# Altium schematic sheet 11-Stimulation.SchDoc: Stimulation
size A2; DocumentNumber: 11; SheetNumber: 11; SheetTotal: 15
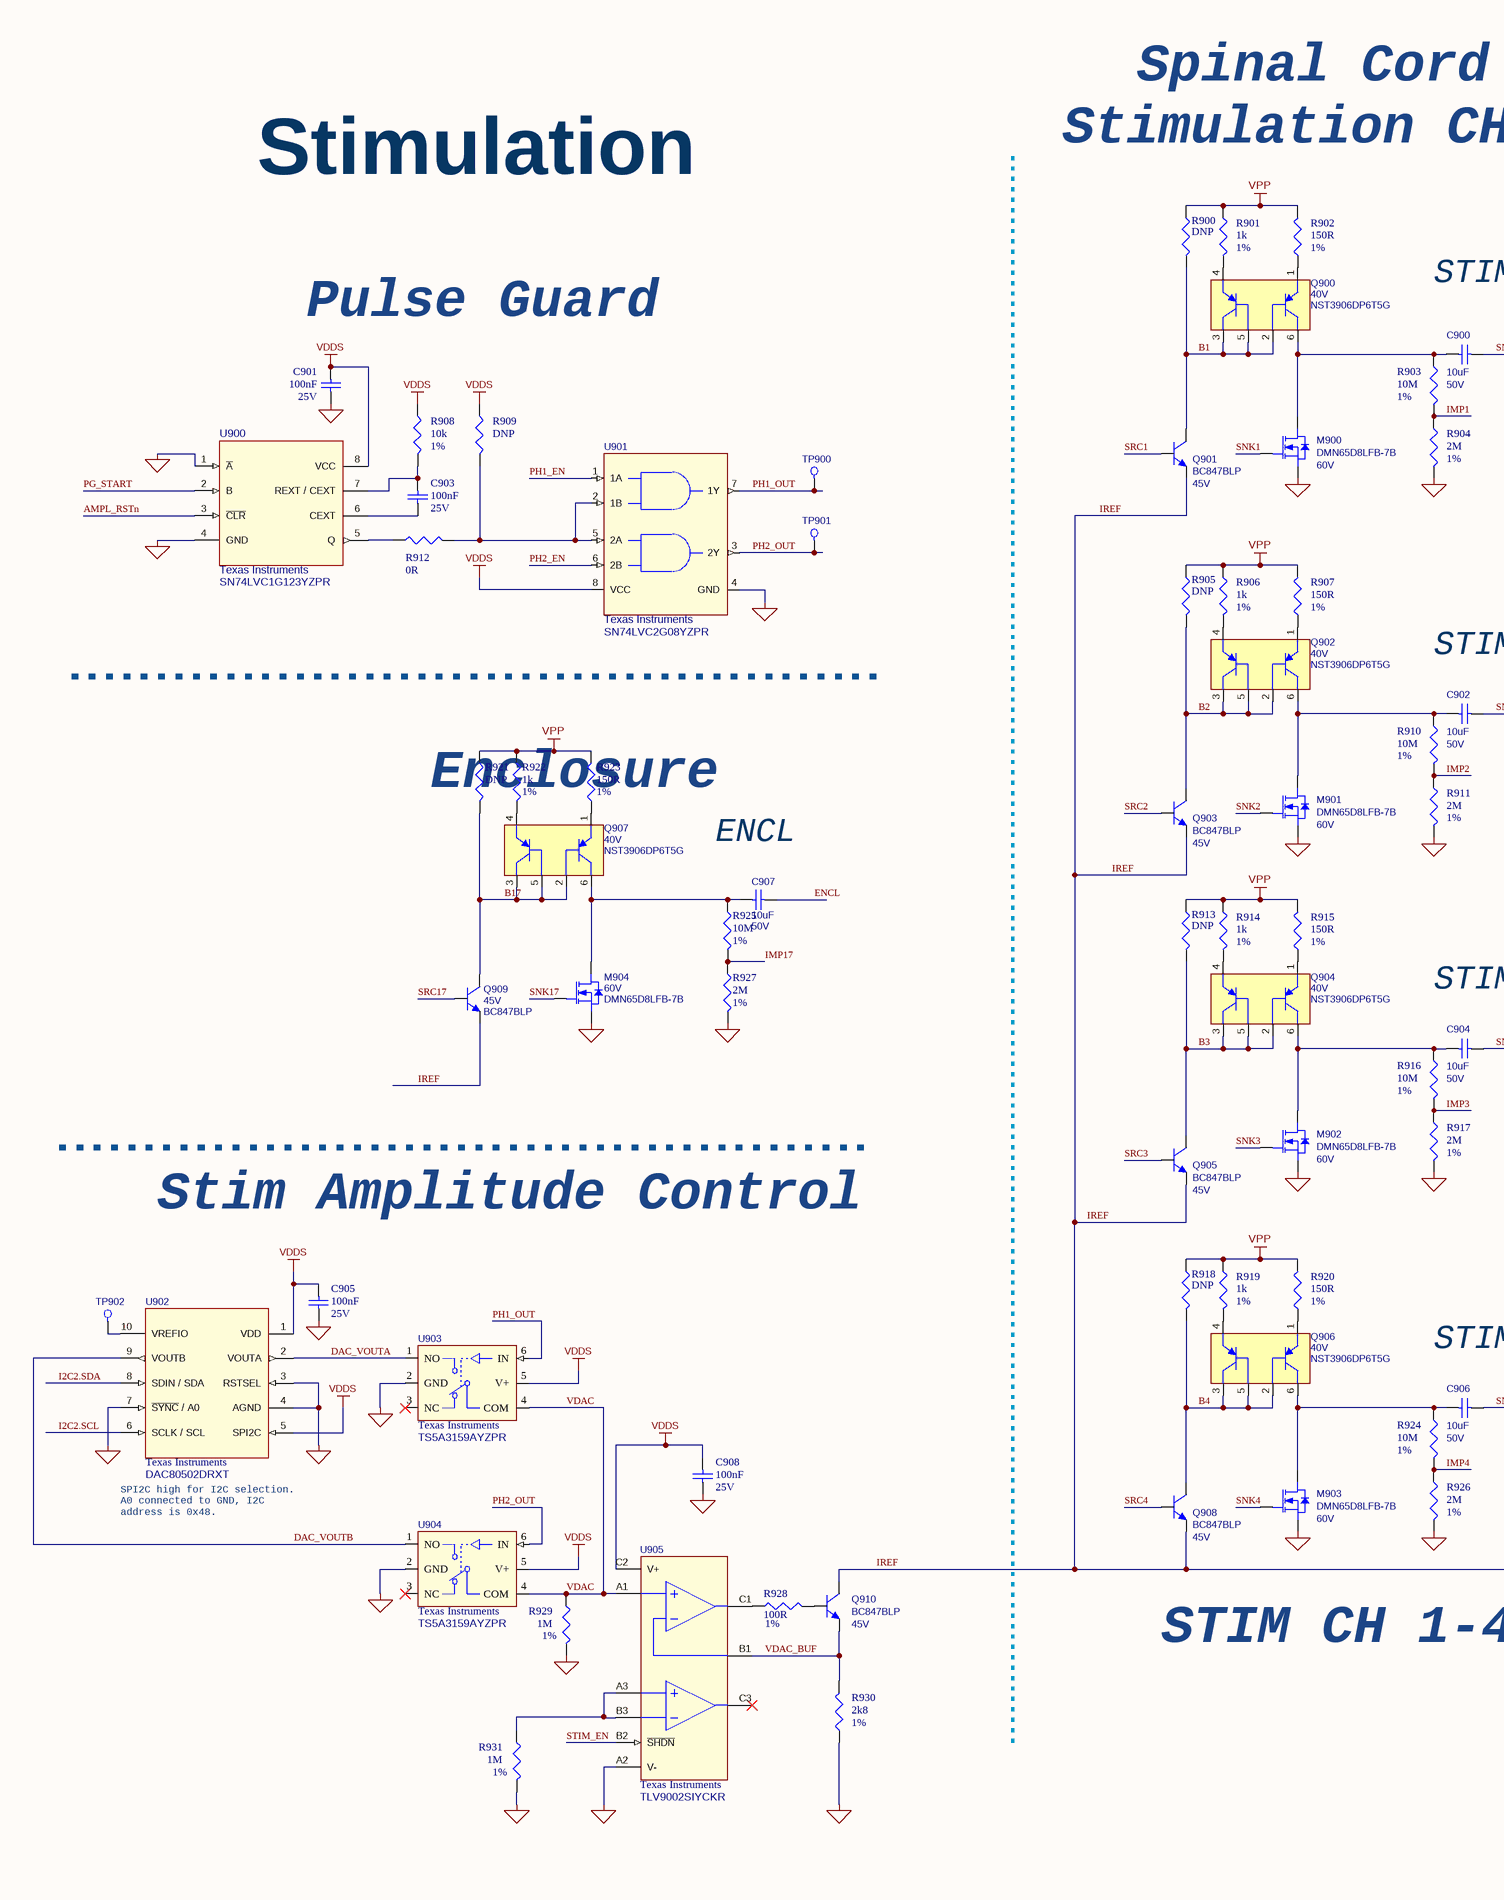
[diagram p0: 11-Stimulation.SchDoc, left]
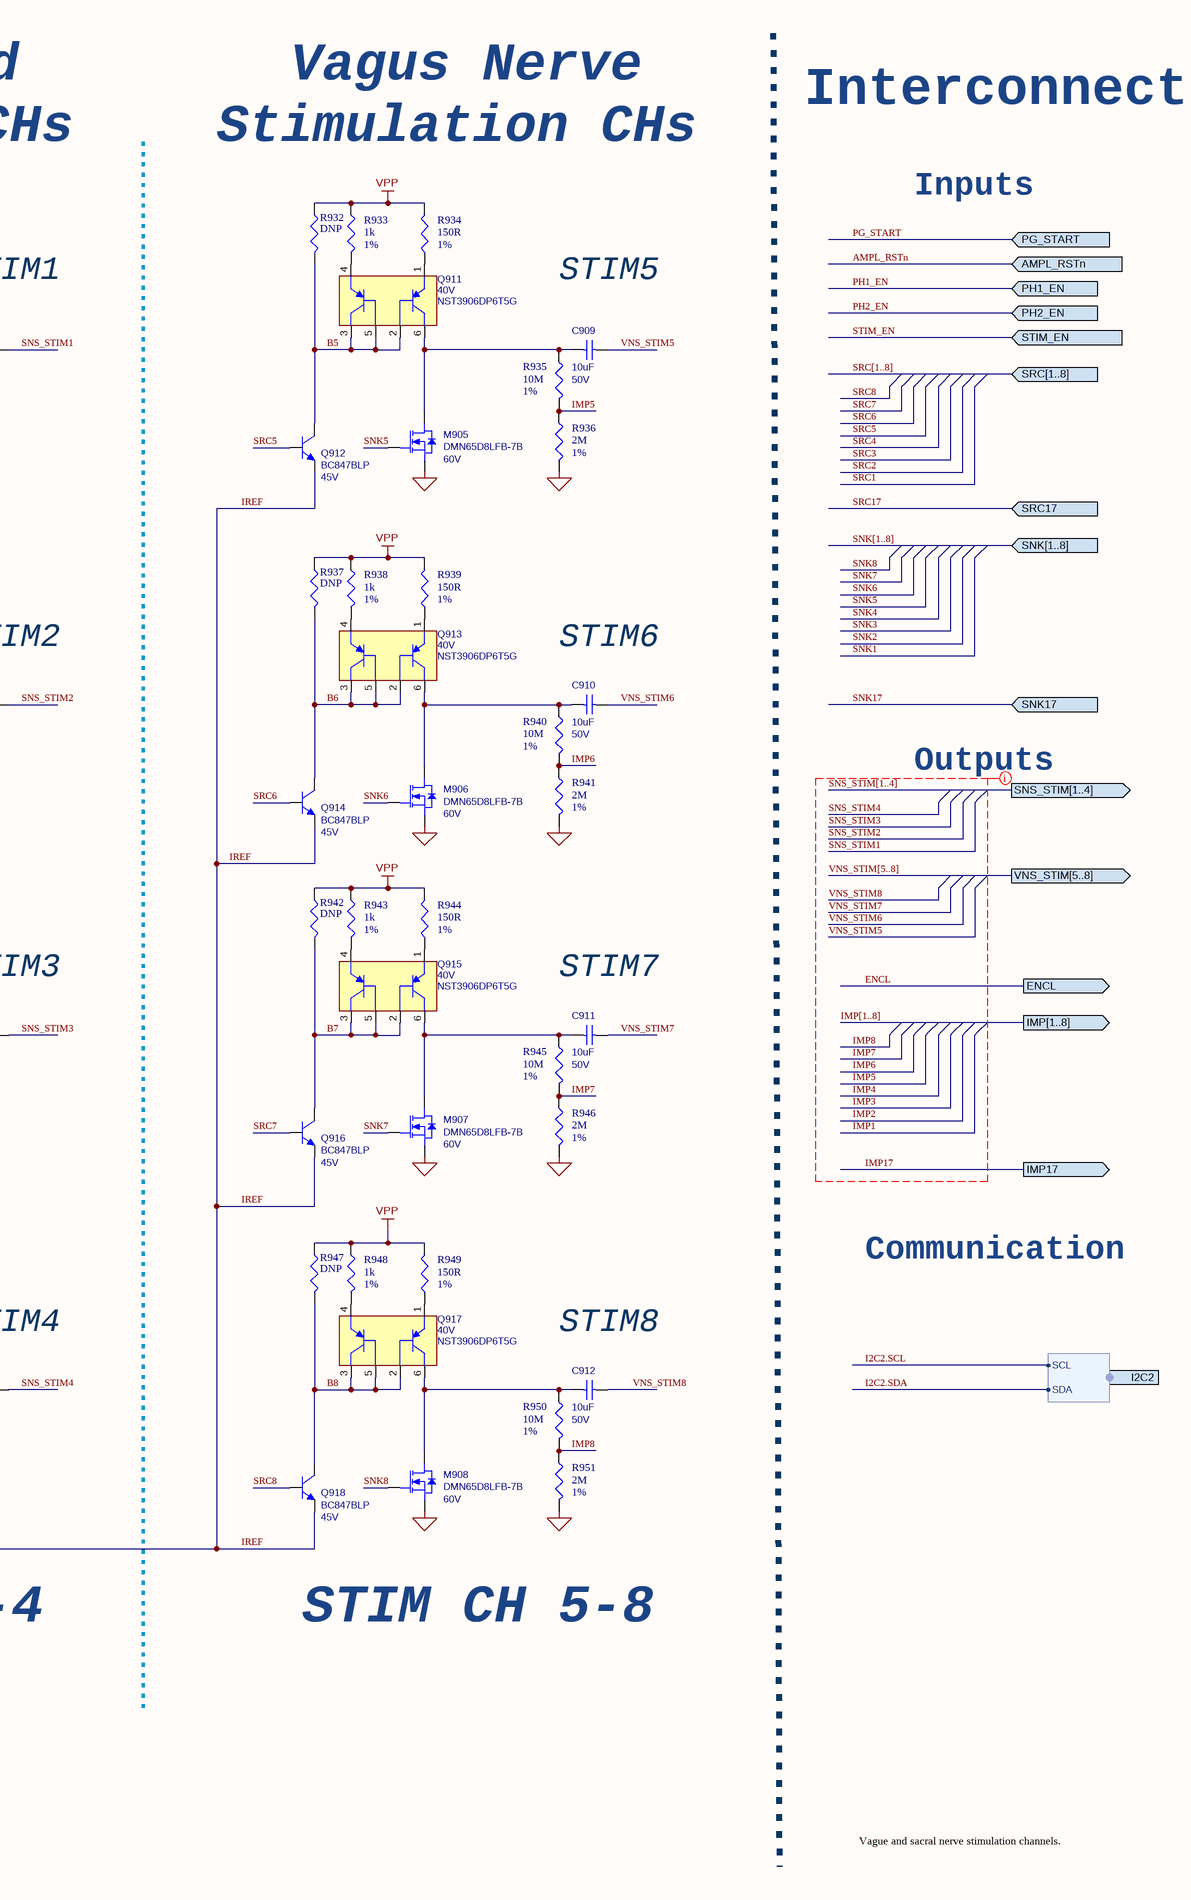
[diagram p1: 11-Stimulation.SchDoc, right]

## Parts
C900  value 10uF  Rating: 50V  [CAP0805_REDUCED]  (hidden comment: GRM21BR61H106ME43L)
C901  value 100nF  Rated DC Voltage (URdc): 25V  [C0201_C]  (hidden comment: GRM033R61E104KE14J)
C902  value 10uF  Rating: 50V  [CAP0805_REDUCED]  (hidden comment: GRM21BR61H106ME43L)
C903  value 100nF  Rated DC Voltage (URdc): 25V  [C0201_C]  (hidden comment: GRM033R61E104KE14J)
C904  value 10uF  Rating: 50V  [CAP0805_REDUCED]  (hidden comment: GRM21BR61H106ME43L)
C905  value 100nF  Rated DC Voltage (URdc): 25V  [C0201_C]  (hidden comment: GRM033R61E104KE14J)
C906  value 10uF  Rating: 50V  [CAP0805_REDUCED]  (hidden comment: GRM21BR61H106ME43L)
C907  value 10uF  Rating: 50V  [CAP0805_REDUCED]  (hidden comment: GRM21BR61H106ME43L)
C908  value 100nF  Rated DC Voltage (URdc): 25V  [C0201_C]  (hidden comment: GRM033R61E104KE14J)
C909  value 10uF  Rating: 50V  [CAP0805_REDUCED]  (hidden comment: GRM21BR61H106ME43L)
C910  value 10uF  Rating: 50V  [CAP0805_REDUCED]  (hidden comment: GRM21BR61H106ME43L)
C911  value 10uF  Rating: 50V  [CAP0805_REDUCED]  (hidden comment: GRM21BR61H106ME43L)
C912  value 10uF  Rating: 50V  [CAP0805_REDUCED]  (hidden comment: GRM21BR61H106ME43L)
M900  Rating: 60V  [DIODESINC_X1-DFN1006-3]  (hidden comment: DMN65D8LFB-7B)
M901  Rating: 60V  [DIODESINC_X1-DFN1006-3]  (hidden comment: DMN65D8LFB-7B)
M902  Rating: 60V  [DIODESINC_X1-DFN1006-3]  (hidden comment: DMN65D8LFB-7B)
M903  Rating: 60V  [DIODESINC_X1-DFN1006-3]  (hidden comment: DMN65D8LFB-7B)
M904  Rating: 60V  [DIODESINC_X1-DFN1006-3]  (hidden comment: DMN65D8LFB-7B)
M905  Rating: 60V  [DIODESINC_X1-DFN1006-3]  (hidden comment: DMN65D8LFB-7B)
M906  Rating: 60V  [DIODESINC_X1-DFN1006-3]  (hidden comment: DMN65D8LFB-7B)
M907  Rating: 60V  [DIODESINC_X1-DFN1006-3]  (hidden comment: DMN65D8LFB-7B)
M908  Rating: 60V  [DIODESINC_X1-DFN1006-3]  (hidden comment: DMN65D8LFB-7B)
Q900  Rating: 40V  [DIODESINC_SOT-963-6]  (hidden comment: NST3906DP6T5G)
Q901  value BC847BLP  Rating: 45V  [DIODESINC_X1-DFN1006-3]  (hidden comment: BC847BLP-7B)
Q902  Rating: 40V  [DIODESINC_SOT-963-6]  (hidden comment: NST3906DP6T5G)
Q903  value BC847BLP  Rating: 45V  [DIODESINC_X1-DFN1006-3]  (hidden comment: BC847BLP-7B)
Q904  Rating: 40V  [DIODESINC_SOT-963-6]  (hidden comment: NST3906DP6T5G)
Q905  value BC847BLP  Rating: 45V  [DIODESINC_X1-DFN1006-3]  (hidden comment: BC847BLP-7B)
Q906  Rating: 40V  [DIODESINC_SOT-963-6]  (hidden comment: NST3906DP6T5G)
Q907  Rating: 40V  [DIODESINC_SOT-963-6]  (hidden comment: NST3906DP6T5G)
Q908  value BC847BLP  Rating: 45V  [DIODESINC_X1-DFN1006-3]  (hidden comment: BC847BLP-7B)
Q909  value BC847BLP  Rating: 45V  [DIODESINC_X1-DFN1006-3]  (hidden comment: BC847BLP-7B)
Q910  value BC847BLP  Rating: 45V  [DIODESINC_X1-DFN1006-3]  (hidden comment: BC847BLP-7B)
Q911  Rating: 40V  [DIODESINC_SOT-963-6]  (hidden comment: NST3906DP6T5G)
Q912  value BC847BLP  Rating: 45V  [DIODESINC_X1-DFN1006-3]  (hidden comment: BC847BLP-7B)
Q913  Rating: 40V  [DIODESINC_SOT-963-6]  (hidden comment: NST3906DP6T5G)
Q914  value BC847BLP  Rating: 45V  [DIODESINC_X1-DFN1006-3]  (hidden comment: BC847BLP-7B)
Q915  Rating: 40V  [DIODESINC_SOT-963-6]  (hidden comment: NST3906DP6T5G)
Q916  value BC847BLP  Rating: 45V  [DIODESINC_X1-DFN1006-3]  (hidden comment: BC847BLP-7B)
Q917  Rating: 40V  [DIODESINC_SOT-963-6]  (hidden comment: NST3906DP6T5G)
Q918  value BC847BLP  Rating: 45V  [DIODESINC_X1-DFN1006-3]  (hidden comment: BC847BLP-7B)
R900  value DNP  [R0201_C]  (hidden comment: RES_DNP_0201)  (no BOM)
R901  value 1k  Tolerance: 1%  [R0201_C]  (hidden comment: CRCW02011K00FNED)
R902  value 150R  Tolerance: 1%  [R0201_C]  (hidden comment: CRCW0201150RFNED)
R903  value 10M  Tolerance: 1%  [R0201_C]  (hidden comment: CRCW020110M0FNED)
R904  value 2M  Tolerance: 1%  [R0201_C]  (hidden comment: CRCW02012M00FNED)
R905  value DNP  [R0201_C]  (hidden comment: RES_DNP_0201)  (no BOM)
R906  value 1k  Tolerance: 1%  [R0201_C]  (hidden comment: CRCW02011K00FNED)
R907  value 150R  Tolerance: 1%  [R0201_C]  (hidden comment: CRCW0201150RFNED)
R908  value 10k  Tolerance: 1%  [R0201_C]  (hidden comment: CRCW020110K0FNED)
R909  value DNP  [R0201_C]  (hidden comment: RES_DNP_0201)  (no BOM)
R910  value 10M  Tolerance: 1%  [R0201_C]  (hidden comment: CRCW020110M0FNED)
R911  value 2M  Tolerance: 1%  [R0201_C]  (hidden comment: CRCW02012M00FNED)
R912  value 0R  [R0201_C]  (hidden comment: CRCW02010000Z0ED)
R913  value DNP  [R0201_C]  (hidden comment: RES_DNP_0201)  (no BOM)
R914  value 1k  Tolerance: 1%  [R0201_C]  (hidden comment: CRCW02011K00FNED)
R915  value 150R  Tolerance: 1%  [R0201_C]  (hidden comment: CRCW0201150RFNED)
R916  value 10M  Tolerance: 1%  [R0201_C]  (hidden comment: CRCW020110M0FNED)
R917  value 2M  Tolerance: 1%  [R0201_C]  (hidden comment: CRCW02012M00FNED)
R918  value DNP  [R0201_C]  (hidden comment: RES_DNP_0201)  (no BOM)
R919  value 1k  Tolerance: 1%  [R0201_C]  (hidden comment: CRCW02011K00FNED)
R920  value 150R  Tolerance: 1%  [R0201_C]  (hidden comment: CRCW0201150RFNED)
R921  value DNP  [R0201_C]  (hidden comment: RES_DNP_0201)  (no BOM)
R922  value 1k  Tolerance: 1%  [R0201_C]  (hidden comment: CRCW02011K00FNED)
R923  value 150R  Tolerance: 1%  [R0201_C]  (hidden comment: CRCW0201150RFNED)
R924  value 10M  Tolerance: 1%  [R0201_C]  (hidden comment: CRCW020110M0FNED)
R925  value 10M  Tolerance: 1%  [R0201_C]  (hidden comment: CRCW020110M0FNED)
R926  value 2M  Tolerance: 1%  [R0201_C]  (hidden comment: CRCW02012M00FNED)
R927  value 2M  Tolerance: 1%  [R0201_C]  (hidden comment: CRCW02012M00FNED)
R928  value 100R  Tolerance: 1%  [R0201_C]  (hidden comment: CRCW0201100RFNED)
R929  value 1M  Tolerance: 1%  [R0201_C]  (hidden comment: CRCW02011M00FNED)
R930  value 2k8  Tolerance: 1%  [R0201_C]  (hidden comment: CRCW02012K80FNED)
R931  value 1M  Tolerance: 1%  [R0201_C]  (hidden comment: CRCW02011M00FNED)
R932  value DNP  [R0201_C]  (hidden comment: RES_DNP_0201)  (no BOM)
R933  value 1k  Tolerance: 1%  [R0201_C]  (hidden comment: CRCW02011K00FNED)
R934  value 150R  Tolerance: 1%  [R0201_C]  (hidden comment: CRCW0201150RFNED)
R935  value 10M  Tolerance: 1%  [R0201_C]  (hidden comment: CRCW020110M0FNED)
R936  value 2M  Tolerance: 1%  [R0201_C]  (hidden comment: CRCW02012M00FNED)
R937  value DNP  [R0201_C]  (hidden comment: RES_DNP_0201)  (no BOM)
R938  value 1k  Tolerance: 1%  [R0201_C]  (hidden comment: CRCW02011K00FNED)
R939  value 150R  Tolerance: 1%  [R0201_C]  (hidden comment: CRCW0201150RFNED)
R940  value 10M  Tolerance: 1%  [R0201_C]  (hidden comment: CRCW020110M0FNED)
R941  value 2M  Tolerance: 1%  [R0201_C]  (hidden comment: CRCW02012M00FNED)
R942  value DNP  [R0201_C]  (hidden comment: RES_DNP_0201)  (no BOM)
R943  value 1k  Tolerance: 1%  [R0201_C]  (hidden comment: CRCW02011K00FNED)
R944  value 150R  Tolerance: 1%  [R0201_C]  (hidden comment: CRCW0201150RFNED)
R945  value 10M  Tolerance: 1%  [R0201_C]  (hidden comment: CRCW020110M0FNED)
R946  value 2M  Tolerance: 1%  [R0201_C]  (hidden comment: CRCW02012M00FNED)
R947  value DNP  [R0201_C]  (hidden comment: RES_DNP_0201)  (no BOM)
R948  value 1k  Tolerance: 1%  [R0201_C]  (hidden comment: CRCW02011K00FNED)
R949  value 150R  Tolerance: 1%  [R0201_C]  (hidden comment: CRCW0201150RFNED)
R950  value 10M  Tolerance: 1%  [R0201_C]  (hidden comment: CRCW020110M0FNED)
R951  value 2M  Tolerance: 1%  [R0201_C]  (hidden comment: CRCW02012M00FNED)
TP900  Test Point  [testpad_0.9mm]  (value not drawn)  (no BOM)
TP901  Test Point  [testpad_0.9mm]  (value not drawn)  (no BOM)
TP902  Test Point  [testpad_0.9mm]  (value not drawn)  (no BOM)
U900  Manufacturer: Texas Instruments  [TI_YZP0008]  (hidden comment: SN74LVC1G123YZPR)
U901  Manufacturer: Texas Instruments  [TI_YZP0008]  (hidden comment: SN74LVC2G08YZPR)
U902  Manufacturer: Texas Instruments  [TI_DRX0010A]  (hidden comment: DAC80502DRXT)
U903  Manufacturer: Texas Instruments  [TI_YZP6]  (hidden comment: TS5A3159AYZPR)
U904  Manufacturer: Texas Instruments  [TI_YZP6]  (hidden comment: TS5A3159AYZPR)
U905  Manufacturer: Texas Instruments  [TI_YCK0009]  (hidden comment: TLV9002SIYCKR)

## Ports
AMPL_RSTn (in), ENCL (out), I2C2 (harness I2C), IMP17 (out), IMP[1..8] (out), PG_START (in), PH1_EN (in), PH2_EN (in), SNK17 (in), SNK[1..8] (in), SNS_STIM[1..4] (out), SRC17 (in), SRC[1..8] (in), STIM_EN (in), VNS_STIM[5..8] (out)

## Harnesses
I2C: SDA, SCL

## Nets
GND: C901.1 C905.1 C908.1 M900.2(S) M901.2(S) M902.2(S) M903.2(S) M904.2(S) M905.2(S) M906.2(S) M907.2(S) M908.2(S) R904.2 R911.2 R917.2 R926.2 R927.2 R929.2 R930.1 R931.2 R936.2 R941.2 R946.2 R951.2 U900.1(~{A}) U900.4(GND) U901.4(GND) U902.3(RSTSEL) U902.4(AGND) U902.7(~{SYNC}_/_A0) U903.2(GND) U904.2(GND) U905.A2(V-)
VDDS: C901.2 C905.2 C908.2 R908.1 R909.1 U900.8(VCC) U901.8(VCC) U902.1(VDD) U902.5(SPI2C) U903.5(V+) U904.5(V+) U905.C2(V+)
VPP: R900.1 R901.1 R902.2 R905.1 R906.1 R907.2 R913.1 R914.1 R915.2 R918.1 R919.1 R920.2 R921.1 R922.1 R923.2 R932.1 R933.1 R934.2 R937.1 R938.1 R939.2 R942.1 R943.1 R944.2 R947.1 R948.1 R949.2
AMPL_RSTn: U900.3(~{CLR}) ; port AMPL_RSTn
B1: Q900.2(B2) Q900.3(C1) Q900.5(B1) Q901.3(C) R900.2
B2: Q902.2(B2) Q902.3(C1) Q902.5(B1) Q903.3(C) R905.2
B3: Q904.2(B2) Q904.3(C1) Q904.5(B1) Q905.3(C) R913.2
B4: Q906.2(B2) Q906.3(C1) Q906.5(B1) Q908.3(C) R918.2
B5: Q911.2(B2) Q911.3(C1) Q911.5(B1) Q912.3(C) R932.2
B6: Q913.2(B2) Q913.3(C1) Q913.5(B1) Q914.3(C) R937.2
B7: Q915.2(B2) Q915.3(C1) Q915.5(B1) Q916.3(C) R942.2
B8: Q917.2(B2) Q917.3(C1) Q917.5(B1) Q918.3(C) R947.2
B17: Q907.2(B2) Q907.3(C1) Q907.5(B1) Q909.3(C) R921.2
DAC_VOUTA: U902.2(VOUTA) U903.1(NO)
DAC_VOUTB: U902.9(VOUTB) U904.1(NO)
ENCL: C907.2 ; port ENCL
I2C2.SCL: U902.6(SCLK_/_SCL) ; port I2C2.SCL
I2C2.SDA: U902.8(SDIN_/_SDA) ; port I2C2.SDA
IMP1: R903.2 R904.1
IMP2: R910.2 R911.1
IMP3: R916.2 R917.1
IMP4: R924.2 R926.1
IMP5: R935.2 R936.1
IMP6: R940.2 R941.1
IMP7: R945.2 R946.1
IMP8: R950.2 R951.1
IMP17: R925.2 R927.1 ; port IMP17
IREF: Q901.2(E) Q903.2(E) Q905.2(E) Q908.2(E) Q909.2(E) Q910.3(C) Q912.2(E) Q914.2(E) Q916.2(E) Q918.2(E)
PG_START: U900.2(B) ; port PG_START
PH1_EN: U901.1(1A) ; port PH1_EN
PH1_OUT: TP900.1 U901.7(1Y) U903.6(IN)
PH2_EN: U901.6(2B) ; port PH2_EN
PH2_OUT: TP901.1 U901.3(2Y) U904.6(IN)
SNK1: M900.1(G)
SNK2: M901.1(G)
SNK3: M902.1(G)
SNK4: M903.1(G)
SNK5: M905.1(G)
SNK6: M906.1(G)
SNK7: M907.1(G)
SNK8: M908.1(G)
SNK17: M904.1(G) ; port SNK17
SNS_STIM1: C900.2
SNS_STIM2: C902.2
SNS_STIM3: C904.2
SNS_STIM4: C906.2
SRC1: Q901.1(B)
SRC2: Q903.1(B)
SRC3: Q905.1(B)
SRC4: Q908.1(B)
SRC5: Q912.1(B)
SRC6: Q914.1(B)
SRC7: Q916.1(B)
SRC8: Q918.1(B)
SRC17: Q909.1(B) ; port SRC17
STIM_EN: U905.B2(~{SHDN}) ; port STIM_EN
VDAC: R929.1 U903.4(COM) U904.4(COM) U905.A1(IN1+)
VDAC_BUF: Q910.2(E) R930.2 U905.B1(IN1-)
VNS_STIM5: C909.2
VNS_STIM6: C910.2
VNS_STIM7: C911.2
VNS_STIM8: C912.2
NetC900_1: C900.1 M900.3(D) Q900.6(C2) R903.1
NetC902_1: C902.1 M901.3(D) Q902.6(C2) R910.1
NetC903_1: C903.1 U900.6(CEXT)
NetC903_2: C903.2 R908.2 U900.7(REXT_/_CEXT)
NetC904_1: C904.1 M902.3(D) Q904.6(C2) R916.1
NetC906_1: C906.1 M903.3(D) Q906.6(C2) R924.1
NetC907_1: C907.1 M904.3(D) Q907.6(C2) R925.1
NetC909_1: C909.1 M905.3(D) Q911.6(C2) R935.1
NetC910_1: C910.1 M906.3(D) Q913.6(C2) R940.1
NetC911_1: C911.1 M907.3(D) Q915.6(C2) R945.1
NetC912_1: C912.1 M908.3(D) Q917.6(C2) R950.1
NetQ900_1: Q900.1(E2) R902.1
NetQ900_4: Q900.4(E1) R901.2
NetQ902_1: Q902.1(E2) R907.1
NetQ902_4: Q902.4(E1) R906.2
NetQ904_1: Q904.1(E2) R915.1
NetQ904_4: Q904.4(E1) R914.2
NetQ906_1: Q906.1(E2) R920.1
NetQ906_4: Q906.4(E1) R919.2
NetQ907_1: Q907.1(E2) R923.1
NetQ907_4: Q907.4(E1) R922.2
NetQ910_1: Q910.1(B) R928.2
NetQ911_1: Q911.1(E2) R934.1
NetQ911_4: Q911.4(E1) R933.2
NetQ913_1: Q913.1(E2) R939.1
NetQ913_4: Q913.4(E1) R938.2
NetQ915_1: Q915.1(E2) R944.1
NetQ915_4: Q915.4(E1) R943.2
NetQ917_1: Q917.1(E2) R949.1
NetQ917_4: Q917.4(E1) R948.2
NetR909_2: R909.2 R912.2 U901.2(1B) U901.5(2A)
NetR912_1: R912.1 U900.5(Q)
NetR928_1: R928.1 U905.C1(OUT1)
NetR931_1: R931.1 U905.A3(IN2+) U905.B3(IN2-)
NetTP902_1: TP902.1 U902.10(VREFIO)

Not connected (* = marked no-connect by the designer): U903 3(NC)*; U904 3(NC)*; U905 C3(OUT2)*

## Buses and harness runs
bus IMP[1..8] = port IMP[1..8]
bus SNK[1..8] = port SNK[1..8]
bus SNS_STIM[1..4] = port SNS_STIM[1..4]
bus SRC[1..8] = port SRC[1..8]
bus VNS_STIM[5..8] = port VNS_STIM[5..8]

## Layout directives
net class ANALOG: ENCL, IMP1, IMP2, IMP3, IMP4, IMP5, IMP6, IMP7, IMP8, IMP17, IMP[1..8], SNS_STIM1, SNS_STIM2, SNS_STIM3, SNS_STIM4, SNS_STIM[1..4], VNS_STIM5, VNS_STIM6, VNS_STIM7, VNS_STIM8, VNS_STIM[5..8]

## Notes on the sheet
- Spinal Cord
- Vagus Nerve
- Interconnect
- Stimulation
- Stimulation CHs
- Inputs
- Pulse Guard
- STIM1
- STIM5
- STIM2
- STIM6
- Enclosure
- Outputs
- ENCL
- STIM3
- STIM7
- Stim Amplitude Control
- Communication
- STIM4
- STIM8
- SPI2C high for I2C selection. A0 connected to GND, I2C address is 0x48.
- STIM CH 1-4
- STIM CH 5-8
- Vague and sacral nerve stimulation channels.
- Project:
- Schematic:
- Design by:
- Date:
- Ver:
- .
- Comments:
- Reviewed by:

## Library data of the parts
C900 C902 C904 C906 C907 C909-C912 = GRM21BR61H106ME43L: Capacitor, 10uF, X5R, 50V, 10%, 0805; Manufacturer: Murata; Review: 020823; Length (mm): 2.00 ±0.20; Medical Grade MFR: N/A; Medical Grade MFR PN: N/A; PCB Footprint: cap0805_reduced; Thickness (mm): 1.25 ±0.20; Width (mm): 1.25 ±0.20; Category: Capacitor; Package Description: 0805; Supplier 1: Digi-Key; Supplier Part Number 1: 490-18664-1-ND; Status: Approved; Manufacturer Part Number: GRM21BR61H106ME43L
C901 C903 C905 C908 = GRM033R61E104KE14J: Ceramic Capacitor, Multilayer, Ceramic, 25V, 10% +Tol, 10% -Tol, X5R, 15% TC, 0.1uF, Surface Mount, 0201; Manufacturer: Murata; Multilayer: Yes; Category: Ceramic Capacitors; Supplier: Digikey; Supplier Part Number: 490-14571-1-ND; Manufacturer Part Number: GRM033R61E104KE14J; RoHS: Yes; Stock: 1540851; Pricing: 1=0,1, 10=0,033, 50=0,0192, 100=0,0148, 500=0,01118, 1000=0,00878, 2500=0,00798, 5000=0,00734 (USD); Mounting Technology: Surface Mount; Pins: 2; Dielectric Material: Ceramic; Package Shape: Rectangular; Case/Package: 0201; Terminal Finish: Nickel; Min Operating Temperature: -55°C; Max Operating Temperature: 85°C; JESD-609 Code: e3; Capacitor Type: Ceramic; Tolerance  (fill in as +-): 10%; Package Style: SMTMeter; Packaging: Tape and Reel; Tolerance (fill in as +-): 10%; Temperature Characteristics Code: X5R; Termination: Wraparound; Length: 0.6mm; Width: 0.3mm; Height: 0.3mm; Reach SVHC Compliant: Yes; RoHS Compliant: Yes; ComponentLink1URL: https://psearch.en.murata.com:443/capacitor/product/GRM033R61E104KE14%23.pdf?src-supplier=IHS+Markit; ComponentLink1Description: https://psearch.en.murata.com:443/capacitor/product/GRM033R61E104KE14%23.pdf?src-supplier=IHS+Markit; ComponentLink2URL: http://www.mouser.com/ds/2/281/c02e-2905.pdf?src-supplier=Mouser; ComponentLink2Description: http://www.mouser.com/ds/2/281/c02e-2905.pdf?src-supplier=Mouser; ComponentLink3URL: http://search.murata.co.jp/Ceramy/image/img/A01X/G101/ENG/GRM033R61E104KE14-01.pdf?src-supplier=Digikey; ComponentLink3Description: http://search.murata.co.jp/Ceramy/image/img/A01X/G101/ENG/GRM033R61E104KE14-01.pdf?src-supplier=Digikey; ComponentLink4URL: https://search.murata.co.jp/Ceramy/image/img/A01X/G101/ENG/GRM033R61E104KE14-01.pdf?src-supplier=Digikey; ComponentLink4Description: https://search.murata.co.jp/Ceramy/image/img/A01X/G101/ENG/GRM033R61E104KE14-01.pdf?src-supplier=Digikey; Supplier 1: Arrow Electronics; Supplier Part Number 1: GRM033R61E104KE14J
M900-M908 = DMN65D8LFB-7B: MOSFET, N-Chan, 60V, 210mA, DFN1006; Manufacturer: Diodes Inc; Medical Grade MFR: TBD; Review: 020823; Category: Transistor; Length (mm): 1.00 ±0.08; Medical Grade MFR PN: TBD; PCB Footprint: TBD; Thickness (mm): 0.50 ±0.03; Value: DMN65D8LFB-7B; Width (mm): 0.60 ±0.08; Supplier 1: Digi-Key; Supplier Part Number 1: DMN65D8LFB-7BDICT-ND; Status: Approved; Manufacturer Part Number: DMN65D8LFB-7B
Q900 Q902 Q904 Q906 Q907 Q911 Q913 Q915 Q917 = NST3906DP6T5G: TRANS 2PNP 40V 0.2A SOT963; Manufacturer: ON Semi; Medical Grade MFR: TBD; Category: Transistor; Length (mm): 1.00 ±0.05; Medical Grade MFR PN: TBD; PCB Footprint: TBD; Thickness (mm): 0.45 ±0.05; Value: NST3906DP6T5G; Width (mm): 1.00 ±0.05; Package Description: SOT963; Supplier 1: Digi-Key; Supplier Part Number 1: NST3906DP6T5GOSCT-ND; Status: *; Review: *; Manufacturer Part Number: NST3906DP6T5G
Q901 Q903 Q905 Q908-Q910 Q912 Q914 Q916 Q918 = BC847BLP-7B: Transistor, NPN, 45V, 100mA, DFN1006; Manufacturer: Diodes Inc; Medical Grade MFR: TBD; Category: Transistor; Length (mm): 1.00 ±0.08; Medical Grade MFR PN: TBD; PCB Footprint: TBD; Thickness (mm): 0.50 ±0.03; Width (mm): 0.60 ±0.08; Supplier 1: Digi-Key; Supplier Part Number 1: BC847BLP-7BDICT-ND; Status: *; Review: *; Manufacturer Part Number: BC847BLP-7B
R901 R906 R914 R919 R922 R933 R938 R943 R948 = CRCW02011K00FNED: Fixed Resistor, Metal Glaze/thick Film, 0.05W, 1000ohm, 30V, 1% +/-Tol, 200ppm/Cel, Surface Mount, 0201; Manufacturer: Vishay; Medical Grade MFR: Mini-Systems; Medical Grade MFR PN: MWA96SM-1001F-NS62TR; Power: 50mW; Rated Temperature: 70°C; Temperature Coefficient: 200ppm/°C; Package Height: 0.23mm; Package Length: 0.6mm; Package Width: 0.3mm; Reference Standard: AEC-Q200; Category: Chip SMD Resistors; Supplier: Digikey; Supplier Part Number: 541-1.00KABCT-ND; Manufacturer Part Number: CRCW02011K00FNED; RoHS: Yes; Stock: 303224; Pricing: 1=0,1, 10=0,037, 50=0,0242, 100=0,0204, 500=0,01426, 1000=0,01241, 5000=0,00924 (USD); Mounting Technology: Surface Mount; Pins: 2; Package Shape: Rectangular; Case/Package: 0201; Terminal Finish: Nickel; Min Operating Temperature: -55°C; Max Operating Temperature: 155°C; JESD-609 Code: e3; Resistor Type: FIXED RESISTOR; Construction: Chip; Package Style: SMTMeter; Packaging: Tape and Reel; Technology: METAL GLAZE/THICK FILM; Termination: Wraparound; Working Voltage: 30V; Reach SVHC Compliant: Yes; RoHS Compliant: Yes; ComponentLink1URL: https://datasheet.ciiva.com:443/pdfs/VipMasterIC/IC/VISH/VISH-S-A0002932828/VISH-S-A0002932828-1.pdf?src-supplier=IHS+Markit; ComponentLink1Description: https://datasheet.ciiva.com:443/pdfs/VipMasterIC/IC/VISH/VISH-S-A0002932828/VISH-S-A0002932828-1.pdf?src-supplier=IHS+Markit; ComponentLink2URL: https://datasheet.ciiva.com/7983/1719906-7983324.pdf?src-supplier=Element14; ComponentLink2Description: https://datasheet.ciiva.com/7983/1719906-7983324.pdf?src-supplier=Element14; ComponentLink3URL: https://datasheet.ciiva.com/7983/1719906-7983323.pdf?src-supplier=Element14; ComponentLink3Description: https://datasheet.ciiva.com/7983/1719906-7983323.pdf?src-supplier=Element14; ComponentLink4URL: https://datasheet.ciiva.com/22692/1719906-22692751.pdf?src-supplier=Element14; ComponentLink4Description: https://datasheet.ciiva.com/22692/1719906-22692751.pdf?src-supplier=Element14; ComponentLink5URL: https://datasheet.ciiva.com/22665/1825492-22665818.pdf?src-supplier=Element14; ComponentLink5Description: https://datasheet.ciiva.com/22665/1825492-22665818.pdf?src-supplier=Element14; ComponentLink6URL: https://datasheet.ciiva.com/2474/crcw0201e3-2474801.pdf?src-supplier=Digikey; ComponentLink6Description: https://datasheet.ciiva.com/2474/crcw0201e3-2474801.pdf?src-supplier=Digikey; ComponentLink7URL: https://datasheet.ciiva.com/2474/crcw0201e3-2474802.pdf?src-supplier=Digikey; ComponentLink7Description: https://datasheet.ciiva.com/2474/crcw0201e3-2474802.pdf?src-supplier=Digikey; ComponentLink8URL: https://datasheet.ciiva.com/2474/crcw0201e3-2474800.pdf?src-supplier=Digikey; ComponentLink8Description: https://datasheet.ciiva.com/2474/crcw0201e3-2474800.pdf?src-supplier=Digikey; ComponentLink9URL: https://datasheet.ciiva.com/22871/70202042-22871422.pdf?src-supplier=Allied+Electronics; ComponentLink9Description: https://datasheet.ciiva.com/22871/70202042-22871422.pdf?src-supplier=Allied+Electronics; ComponentLink10URL: https://datasheet.ciiva.com/3255/crcw0201e3-3255929.pdf?src-supplier=Avnet; ComponentLink10Description: https://datasheet.ciiva.com/3255/crcw0201e3-3255929.pdf?src-supplier=Avnet; Supplier 1: Arrow Electronics; Supplier Part Number 1: CRCW02011K00FNED
R902 R907 R915 R920 R923 R934 R939 R944 R949 = CRCW0201150RFNED: Fixed Resistor, Metal Glaze/thick Film, 0.05W, 150ohm, 30V, 1% +/-Tol, 200ppm/Cel, Surface Mount, 0201; Manufacturer: Vishay; Medical Grade MFR: Mini-Systems; Medical Grade MFR PN: MWA96SM-1500F-NS62TR; Power: 50mW; Rated Temperature: 70°C; Temperature Coefficient: 200ppm/°C; Package Height: 0.23mm; Package Length: 0.6mm; Package Width: 0.3mm; Reference Standard: AEC-Q200; Category: Chip SMD Resistors; Supplier: Digikey; Supplier Part Number: 541-CRCW0201150RFNEDCT-ND; Manufacturer Part Number: CRCW0201150RFNED; RoHS: Yes; Stock: 19000; Pricing: 1=0,1, 10=0,037, 50=0,0242, 100=0,0204, 500=0,01426, 1000=0,01241, 5000=0,00924 (USD); Mounting Technology: Surface Mount; Pins: 2; Package Shape: Rectangular; Case/Package: 0201; Terminal Finish: Nickel; Min Operating Temperature: -55°C; Max Operating Temperature: 155°C; JESD-609 Code: e3; Resistor Type: FIXED RESISTOR; Construction: Chip; Package Style: SMTMeter; Packaging: Tape and Reel; Technology: METAL GLAZE/THICK FILM; Termination: Wraparound; Working Voltage: 30V; Reach SVHC Compliant: Yes; RoHS Compliant: Yes; ComponentLink1URL: https://datasheet.ciiva.com:443/pdfs/VipMasterIC/IC/VISH/VISH-S-A0002932828/VISH-S-A0002932828-1.pdf?src-supplier=IHS+Markit; ComponentLink1Description: https://datasheet.ciiva.com:443/pdfs/VipMasterIC/IC/VISH/VISH-S-A0002932828/VISH-S-A0002932828-1.pdf?src-supplier=IHS+Markit; ComponentLink2URL: https://datasheet.ciiva.com/2577/crcw0201e3-2577126.pdf?src-supplier=Digikey; ComponentLink2Description: https://datasheet.ciiva.com/2577/crcw0201e3-2577126.pdf?src-supplier=Digikey; ComponentLink3URL: https://datasheet.ciiva.com/8969/crcw0201e3-8969797.pdf?src-supplier=Avnet; ComponentLink3Description: https://datasheet.ciiva.com/8969/crcw0201e3-8969797.pdf?src-supplier=Avnet; ComponentLink4URL: https://datasheet.ciiva.com/7777/1719906-7777159.pdf?src-supplier=Element14; ComponentLink4Description: https://datasheet.ciiva.com/7777/1719906-7777159.pdf?src-supplier=Element14; ComponentLink5URL: https://datasheet.ciiva.com/7777/1719906-7777160.pdf?src-supplier=Element14; ComponentLink5Description: https://datasheet.ciiva.com/7777/1719906-7777160.pdf?src-supplier=Element14; Supplier 1: Digikey; Supplier Part Number 1: 541-CRCW0201150RFNEDCT-ND
R903 R910 R916 R924 R925 R935 R940 R945 R950 = CRCW020110M0FNED: Fixed Resistor, Metal Glaze/thick Film, 0.05W, 10000000ohm, 30V, 1% +/-Tol, 200ppm/Cel, Surface Mount, 0201; Manufacturer: Vishay Draloric; Medical Grade MFR: Mini-Systems; Medical Grade MFR PN: MWA96SM-1005F-NS62TR; Power: 50mW; Rated Temperature: 70°C; Temperature Coefficient: 200ppm/°C; Category: Chip SMD Resistors; Supplier: Mouser; Supplier Part Number: 71-CRCW020110M0FNED; Manufacturer Part Number: CRCW020110M0FNED; RoHS: Yes; Stock: 159754; Pricing: 1=0,1, 10=0,024, 50=0,024, 100=0,014, 1000=0,011, 10000=0,006 (USD); Mounting Technology: Surface Mount; Pins: 2; Package Shape: Rectangular; Case/Package: 0201; Terminal Finish: Nickel; Min Operating Temperature: -55°C; Max Operating Temperature: 155°C; JESD-609 Code: e3; Resistor Type: FIXED RESISTOR; Packaging: Tape and Reel; Technology: METAL GLAZE/THICK FILM; Termination: Wraparound; Working Voltage: 30V; Reach SVHC Compliant: Yes; RoHS Compliant: Yes; ComponentLink1URL: https://datasheet.ciiva.com:443/pdfs/VipMasterIC/IC/VISH/VISH-S-A0002932828/VISH-S-A0002932828-1.pdf?src-supplier=IHS+Markit; ComponentLink1Description: https://datasheet.ciiva.com:443/pdfs/VipMasterIC/IC/VISH/VISH-S-A0002932828/VISH-S-A0002932828-1.pdf?src-supplier=IHS+Markit; ComponentLink2URL: https://datasheet.ciiva.com/7673/1719906-7673177.pdf?src-supplier=Element14; ComponentLink2Description: https://datasheet.ciiva.com/7673/1719906-7673177.pdf?src-supplier=Element14; ComponentLink3URL: https://datasheet.ciiva.com/7673/1719906-7673178.pdf?src-supplier=Element14; ComponentLink3Description: https://datasheet.ciiva.com/7673/1719906-7673178.pdf?src-supplier=Element14; ComponentLink4URL: https://datasheet.ciiva.com/22692/1719906-22692711.pdf?src-supplier=Element14; ComponentLink4Description: https://datasheet.ciiva.com/22692/1719906-22692711.pdf?src-supplier=Element14; ComponentLink5URL: https://datasheet.ciiva.com/22665/1700795-22665701.pdf?src-supplier=Element14; ComponentLink5Description: https://datasheet.ciiva.com/22665/1700795-22665701.pdf?src-supplier=Element14; Supplier 1: Digikey; Supplier Part Number 1: 541-CRCW020110M0FNEDCT-ND
R904 R911 R917 R926 R927 R936 R941 R946 R951 = CRCW02012M00FNED: Fixed Resistor, Metal Glaze/thick Film, 0.05W, 2000000ohm, 30V, 1% +/-Tol, 200ppm/Cel, Surface Mount, 0201; Manufacturer: Vishay Draloric; Medical Grade MFR: Mini-Systems; Medical Grade MFR PN: MWA96SM-2004F-NS62TR; Power: 50mW; Rated Temperature: 70°C; Temperature Coefficient: 200ppm/°C; Category: Chip SMD Resistors; Supplier: Digikey; Supplier Part Number: 541-CRCW02012M00FNEDCT-ND; Manufacturer Part Number: CRCW02012M00FNED; RoHS: Yes; Stock: 78038; Pricing: 1=0,1, 10=0,037, 50=0,0242, 100=0,0204, 500=0,01426, 1000=0,01241, 5000=0,00924 (USD); Mounting Technology: Surface Mount; Pins: 2; Package Shape: Rectangular; Case/Package: 0201; Terminal Finish: Nickel; Min Operating Temperature: -55°C; Max Operating Temperature: 155°C; JESD-609 Code: e3; Resistor Type: FIXED RESISTOR; Packaging: Tape and Reel; Technology: METAL GLAZE/THICK FILM; Termination: Wraparound; Working Voltage: 30V; Reach SVHC Compliant: Yes; RoHS Compliant: Yes; ComponentLink1URL: https://datasheet.ciiva.com:443/pdfs/VipMasterIC/IC/VISH/VISH-S-A0002932828/VISH-S-A0002932828-1.pdf?src-supplier=IHS+Markit; ComponentLink1Description: https://datasheet.ciiva.com:443/pdfs/VipMasterIC/IC/VISH/VISH-S-A0002932828/VISH-S-A0002932828-1.pdf?src-supplier=IHS+Markit; ComponentLink2URL: https://datasheet.ciiva.com/7800/1719906-7800936.pdf?src-supplier=Element14; ComponentLink2Description: https://datasheet.ciiva.com/7800/1719906-7800936.pdf?src-supplier=Element14; ComponentLink3URL: https://datasheet.ciiva.com/7800/1719906-7800935.pdf?src-supplier=Element14; ComponentLink3Description: https://datasheet.ciiva.com/7800/1719906-7800935.pdf?src-supplier=Element14; ComponentLink4URL: https://datasheet.ciiva.com/22675/1700795-22675402.pdf?src-supplier=Element14; ComponentLink4Description: https://datasheet.ciiva.com/22675/1700795-22675402.pdf?src-supplier=Element14; ComponentLink5URL: https://datasheet.ciiva.com/29926/crcw0201e3-29926056.pdf?src-supplier=Avnet; ComponentLink5Description: https://datasheet.ciiva.com/29926/crcw0201e3-29926056.pdf?src-supplier=Avnet; Supplier 1: Digikey; Supplier Part Number 1: 541-CRCW02012M00FNEDCT-ND
R908 = CRCW020110K0FNED: Fixed Resistor, Metal Glaze/thick Film, 0.05W, 10000ohm, 30V, 1% +/-Tol, 200ppm/Cel, Surface Mount, 0201; Manufacturer: Vishay; Medical Grade MFR: Mini-Systems; Medical Grade MFR PN: MWA96SM-1002F-NS62TR; Power: 50mW; Rated Temperature: 70°C; Temperature Coefficient: 200ppm/°C; Package Height: 0.23mm; Package Length: 0.6mm; Package Width: 0.3mm; Reference Standard: AEC-Q200; Category: Chip SMD Resistors; Supplier: Digikey; Supplier Part Number: 541-10.0KABCT-ND; Manufacturer Part Number: CRCW020110K0FNED; RoHS: Yes; Stock: 1011530; Pricing: 1=0,1, 10=0,037, 50=0,0242, 100=0,0204, 500=0,01426, 1000=0,01241, 5000=0,00924 (USD); Mounting Technology: Surface Mount; Pins: 2; Package Shape: Rectangular; Case/Package: 0201; Terminal Finish: Nickel; Min Operating Temperature: -55°C; Max Operating Temperature: 155°C; JESD-609 Code: e3; Resistor Type: FIXED RESISTOR; Construction: Chip; Package Style: SMTMeter; Packaging: Tape and Reel; Technology: METAL GLAZE/THICK FILM; Termination: Wraparound; Working Voltage: 30V; Reach SVHC Compliant: Yes; RoHS Compliant: Yes; ComponentLink1URL: https://datasheet.ciiva.com:443/pdfs/VipMasterIC/IC/VISH/VISH-S-A0002932828/VISH-S-A0002932828-1.pdf?src-supplier=IHS+Markit; ComponentLink1Description: https://datasheet.ciiva.com:443/pdfs/VipMasterIC/IC/VISH/VISH-S-A0002932828/VISH-S-A0002932828-1.pdf?src-supplier=IHS+Markit; ComponentLink2URL: https://datasheet.ciiva.com/2474/crcw0201e3-2474819.pdf?src-supplier=Digikey; ComponentLink2Description: https://datasheet.ciiva.com/2474/crcw0201e3-2474819.pdf?src-supplier=Digikey; ComponentLink3URL: https://datasheet.ciiva.com/2474/crcw0201e3-2474820.pdf?src-supplier=Digikey; ComponentLink3Description: https://datasheet.ciiva.com/2474/crcw0201e3-2474820.pdf?src-supplier=Digikey; ComponentLink4URL: https://datasheet.ciiva.com/2474/crcw0201e3-2474818.pdf?src-supplier=Digikey; ComponentLink4Description: https://datasheet.ciiva.com/2474/crcw0201e3-2474818.pdf?src-supplier=Digikey; ComponentLink5URL: https://datasheet.ciiva.com/16436/dcrcwe3-16436222.pdf?src-supplier=Future+Electronics; ComponentLink5Description: https://datasheet.ciiva.com/16436/dcrcwe3-16436222.pdf?src-supplier=Future+Electronics; ComponentLink6URL: https://datasheet.ciiva.com/7983/1719906-7983320.pdf?src-supplier=Element14; ComponentLink6Description: https://datasheet.ciiva.com/7983/1719906-7983320.pdf?src-supplier=Element14; ComponentLink7URL: https://datasheet.ciiva.com/7983/1719906-7983319.pdf?src-supplier=Element14; ComponentLink7Description: https://datasheet.ciiva.com/7983/1719906-7983319.pdf?src-supplier=Element14; ComponentLink8URL: https://datasheet.ciiva.com/22692/1719906-22692709.pdf?src-supplier=Element14; ComponentLink8Description: https://datasheet.ciiva.com/22692/1719906-22692709.pdf?src-supplier=Element14; Supplier 1: Mouser; Supplier Part Number 1: 71-CRCW0201-10K
R912 = CRCW02010000Z0ED: Fixed Resistor, Metal Glaze/thick Film, 0.05W, 0ohm, Surface Mount, 0201; Manufacturer: Vishay; Medical Grade MFR: Mini-Systems; Medical Grade MFR PN: MWA96SM-0000F-NS62TR; Power: 50mW; Rated Temperature: 70°C; Package Height: 0.23mm; Package Length: 0.6mm; Package Width: 0.3mm; Reference Standard: AEC-Q200; Category: Chip SMD Resistors; Supplier: Digikey; Supplier Part Number: 541-0.0AGCT-ND; Manufacturer Part Number: CRCW02010000Z0ED; RoHS: Yes; Stock: 701366; Pricing: 1=0,1, 10=0,034, 25=0,026, 50=0,0198, 100=0,0138, 250=0,01112, 500=0,0089, 1000=0,00655, 5000=0,0047 (USD); Mounting Technology: Surface Mount; Pins: 2; Package Shape: Rectangular; Case/Package: 0201; Terminal Finish: Nickel; Min Operating Temperature: -55°C; Max Operating Temperature: 155°C; JESD-609 Code: e3; Resistor Type: FIXED RESISTOR; Construction: Chip; Package Style: SMTMeter; Packaging: Tape and Reel; Technology: METAL GLAZE/THICK FILM; Termination: Wraparound; Reach SVHC Compliant: Yes; RoHS Compliant: Yes; ComponentLink1URL: https://datasheet.ciiva.com:443/pdfs/VipMasterIC/IC/VISH/VISH-S-A0002932828/VISH-S-A0002932828-1.pdf?src-supplier=IHS+Markit; ComponentLink1Description: https://datasheet.ciiva.com:443/pdfs/VipMasterIC/IC/VISH/VISH-S-A0002932828/VISH-S-A0002932828-1.pdf?src-supplier=IHS+Markit; ComponentLink2URL: https://datasheet.ciiva.com/2471/crcw0201e3-2471712.pdf?src-supplier=Digikey; ComponentLink2Description: https://datasheet.ciiva.com/2471/crcw0201e3-2471712.pdf?src-supplier=Digikey; ComponentLink3URL: https://datasheet.ciiva.com/7841/1719906-7841431.pdf?src-supplier=Element14; ComponentLink3Description: https://datasheet.ciiva.com/7841/1719906-7841431.pdf?src-supplier=Element14; ComponentLink4URL: https://datasheet.ciiva.com/7841/1719906-7841430.pdf?src-supplier=Element14; ComponentLink4Description: https://datasheet.ciiva.com/7841/1719906-7841430.pdf?src-supplier=Element14; ComponentLink5URL: https://datasheet.ciiva.com/22665/1847332-22665688.pdf?src-supplier=Element14; ComponentLink5Description: https://datasheet.ciiva.com/22665/1847332-22665688.pdf?src-supplier=Element14; ComponentLink6URL: https://datasheet.ciiva.com/2471/crcw0201e3-2471713.pdf?src-supplier=Digikey; ComponentLink6Description: https://datasheet.ciiva.com/2471/crcw0201e3-2471713.pdf?src-supplier=Digikey; ComponentLink7URL: https://datasheet.ciiva.com/2471/crcw0201e3-2471711.pdf?src-supplier=Digikey; ComponentLink7Description: https://datasheet.ciiva.com/2471/crcw0201e3-2471711.pdf?src-supplier=Digikey; ComponentLink8URL: https://datasheet.ciiva.com/16757/70202042-16757849.pdf?src-supplier=Allied+Electronics; ComponentLink8Description: https://datasheet.ciiva.com/16757/70202042-16757849.pdf?src-supplier=Allied+Electronics; ComponentLink9URL: https://datasheet.ciiva.com/16436/crcw0201e3-16436237.pdf?src-supplier=Future+Electronics; ComponentLink9Description: https://datasheet.ciiva.com/16436/crcw0201e3-16436237.pdf?src-supplier=Future+Electronics; Supplier 1: Digikey; Supplier Part Number 1: 541-0.0AGDKR-ND
R928 = CRCW0201100RFNED: Fixed Resistor, Metal Glaze/thick Film, 0.05W, 100ohm, 30V, 1% +/-Tol, 200ppm/Cel, Surface Mount, 0201; Manufacturer: Vishay; Medical Grade MFR: Mini-Systems; Medical Grade MFR PN: MWA96SM-1000F-NS62TR; Power: 50mW; Rated Temperature: 70°C; Temperature Coefficient: 200ppm/°C; Package Height: 0.23mm; Package Length: 0.6mm; Package Width: 0.3mm; Reference Standard: AEC-Q200; Category: Chip SMD Resistors; Supplier: Digikey; Supplier Part Number: 541-100ABCT-ND; Manufacturer Part Number: CRCW0201100RFNED; RoHS: Yes; Stock: 52904; Pricing: 1=0,1, 10=0,037, 50=0,0242, 100=0,0204, 500=0,01426, 1000=0,01241, 5000=0,00924 (USD); Mounting Technology: Surface Mount; Pins: 2; Package Shape: Rectangular; Terminal Finish: Nickel; Case/Package: 0201; Min Operating Temperature: -55°C; Max Operating Temperature: 155°C; JESD-609 Code: e3; Package Style: SMTMeter; Technology: METAL GLAZE/THICK FILM; Resistor Type: FIXED RESISTOR; Construction: Chip; Packaging: Tape and Reel; Termination: Wraparound; Working Voltage: 30V; Reach SVHC Compliant: Yes; RoHS Compliant: Yes; ComponentLink1URL: https://datasheet.ciiva.com:443/pdfs/VipMasterIC/IC/VISH/VISH-S-A0002932828/VISH-S-A0002932828-1.pdf?src-supplier=IHS+Markit; ComponentLink1Description: https://datasheet.ciiva.com:443/pdfs/VipMasterIC/IC/VISH/VISH-S-A0002932828/VISH-S-A0002932828-1.pdf?src-supplier=IHS+Markit; ComponentLink2URL: https://datasheet.ciiva.com/8083/crcw0201e3-8083961.pdf?src-supplier=Avnet; ComponentLink2Description: https://datasheet.ciiva.com/8083/crcw0201e3-8083961.pdf?src-supplier=Avnet; ComponentLink3URL: https://datasheet.ciiva.com/2527/crcw0201e3-2527593.pdf?src-supplier=Digikey; ComponentLink3Description: https://datasheet.ciiva.com/2527/crcw0201e3-2527593.pdf?src-supplier=Digikey; ComponentLink4URL: https://datasheet.ciiva.com/2527/crcw0201e3-2527591.pdf?src-supplier=Digikey; ComponentLink4Description: https://datasheet.ciiva.com/2527/crcw0201e3-2527591.pdf?src-supplier=Digikey; ComponentLink5URL: https://datasheet.ciiva.com/2527/crcw0201e3-2527592.pdf?src-supplier=Digikey; ComponentLink5Description: https://datasheet.ciiva.com/2527/crcw0201e3-2527592.pdf?src-supplier=Digikey; ComponentLink6URL: https://datasheet.ciiva.com/7983/1719906-7983317.pdf?src-supplier=Element14; ComponentLink6Description: https://datasheet.ciiva.com/7983/1719906-7983317.pdf?src-supplier=Element14; ComponentLink7URL: https://datasheet.ciiva.com/7983/1719906-7983318.pdf?src-supplier=Element14; ComponentLink7Description: https://datasheet.ciiva.com/7983/1719906-7983318.pdf?src-supplier=Element14; ComponentLink8URL: https://datasheet.ciiva.com/16757/70202042-16757607.pdf?src-supplier=Allied+Electronics; ComponentLink8Description: https://datasheet.ciiva.com/16757/70202042-16757607.pdf?src-supplier=Allied+Electronics; ComponentLink9URL: https://datasheet.ciiva.com/16202/dcrcwe3-16202605.pdf?src-supplier=Future+Electronics; ComponentLink9Description: https://datasheet.ciiva.com/16202/dcrcwe3-16202605.pdf?src-supplier=Future+Electronics; ComponentLink10URL: https://datasheet.ciiva.com/22665/1700795-22665690.pdf?src-supplier=Element14; ComponentLink10Description: https://datasheet.ciiva.com/22665/1700795-22665690.pdf?src-supplier=Element14; Supplier 1: Digikey; Supplier Part Number 1: 541-100ABCT-ND
R929 R931 = CRCW02011M00FNED: Fixed Resistor, Metal Glaze/thick Film, 0.05W, 1000000ohm, 30V, 1% +/-Tol, 200ppm/Cel, Surface Mount, 0201; Manufacturer: Vishay; Medical Grade MFR: Mini-Systems; Medical Grade MFR PN: MWA96SM-1004F-NS62TR; Power: 50mW; Rated Temperature: 70°C; Temperature Coefficient: 200ppm/°C; Package Height: 0.23mm; Package Length: 0.6mm; Package Width: 0.3mm; Reference Standard: AEC-Q200; Category: Chip SMD Resistors; Supplier: Digikey; Supplier Part Number: 541-1.00MABCT-ND; Manufacturer Part Number: CRCW02011M00FNED; RoHS: Yes; Stock: 392914; Pricing: 1=0,1, 10=0,037, 50=0,0242, 100=0,0204, 500=0,01426, 1000=0,01241, 5000=0,00924 (USD); Mounting Technology: Surface Mount; Pins: 2; Package Shape: Rectangular; Case/Package: 0201; Terminal Finish: Nickel; Min Operating Temperature: -55°C; Max Operating Temperature: 155°C; JESD-609 Code: e3; Resistor Type: FIXED RESISTOR; Construction: Chip; Package Style: SMTMeter; Packaging: Tape and Reel; Technology: METAL GLAZE/THICK FILM; Termination: Wraparound; Working Voltage: 30V; Reach SVHC Compliant: Yes; RoHS Compliant: Yes; ComponentLink1URL: https://datasheet.ciiva.com:443/pdfs/VipMasterIC/IC/VISH/VISH-S-A0002932828/VISH-S-A0002932828-1.pdf?src-supplier=IHS+Markit; ComponentLink1Description: https://datasheet.ciiva.com:443/pdfs/VipMasterIC/IC/VISH/VISH-S-A0002932828/VISH-S-A0002932828-1.pdf?src-supplier=IHS+Markit; ComponentLink2URL: https://datasheet.ciiva.com/7841/1719906-7841438.pdf?src-supplier=Element14; ComponentLink2Description: https://datasheet.ciiva.com/7841/1719906-7841438.pdf?src-supplier=Element14; ComponentLink3URL: https://datasheet.ciiva.com/7841/1719906-7841439.pdf?src-supplier=Element14; ComponentLink3Description: https://datasheet.ciiva.com/7841/1719906-7841439.pdf?src-supplier=Element14; ComponentLink4URL: https://datasheet.ciiva.com/7859/dcrcwe3-7859689.pdf?src-supplier=Element14; ComponentLink4Description: https://datasheet.ciiva.com/7859/dcrcwe3-7859689.pdf?src-supplier=Element14; ComponentLink5URL: https://datasheet.ciiva.com/16757/70202042-16757675.pdf?src-supplier=Allied+Electronics; ComponentLink5Description: https://datasheet.ciiva.com/16757/70202042-16757675.pdf?src-supplier=Allied+Electronics; ComponentLink6URL: https://datasheet.ciiva.com/22692/1719906-22692761.pdf?src-supplier=Element14; ComponentLink6Description: https://datasheet.ciiva.com/22692/1719906-22692761.pdf?src-supplier=Element14; ComponentLink7URL: https://datasheet.ciiva.com/9109/crcw0201e3-9109910.pdf?src-supplier=Avnet; ComponentLink7Description: https://datasheet.ciiva.com/9109/crcw0201e3-9109910.pdf?src-supplier=Avnet; ComponentLink8URL: https://datasheet.ciiva.com/22675/1847332-22675065.pdf?src-supplier=Element14; ComponentLink8Description: https://datasheet.ciiva.com/22675/1847332-22675065.pdf?src-supplier=Element14; ComponentLink9URL: https://datasheet.ciiva.com/2474/crcw0201e3-2474824.pdf?src-supplier=Digikey; ComponentLink9Description: https://datasheet.ciiva.com/2474/crcw0201e3-2474824.pdf?src-supplier=Digikey; ComponentLink10URL: https://datasheet.ciiva.com/2474/crcw0201e3-2474825.pdf?src-supplier=Digikey; ComponentLink10Description: https://datasheet.ciiva.com/2474/crcw0201e3-2474825.pdf?src-supplier=Digikey; ComponentLink11URL: https://datasheet.ciiva.com/2474/crcw0201e3-2474826.pdf?src-supplier=Digikey; ComponentLink11Description: https://datasheet.ciiva.com/2474/crcw0201e3-2474826.pdf?src-supplier=Digikey; Supplier 1: Digikey; Supplier Part Number 1: 541-1.00MABCT-ND
R930 = CRCW02012K80FNED: Fixed Resistor, Metal Glaze/thick Film, 0.05W, 2800ohm, 30V, 1% +/-Tol, 200ppm/Cel, Surface Mount, 0201; Manufacturer: Vishay; Medical Grade MFR: Mini-Systems; Medical Grade MFR PN: MWA96SM-2801F-NS62TR; Power: 50mW; Rated Temperature: 70°C; Temperature Coefficient: 200ppm/°C; Package Height: 0.23mm; Package Length: 0.6mm; Package Width: 0.3mm; Reference Standard: AEC-Q200; Category: Chip SMD Resistors; Supplier: Digikey; Supplier Part Number: 541-CRCW02012K80FNEDCT-ND; Manufacturer Part Number: CRCW02012K80FNED; RoHS: Yes; Stock: 8141; Pricing: 1=0,1, 10=0,037, 50=0,0242, 100=0,0204, 500=0,01426, 1000=0,01241, 5000=0,00924 (USD); Mounting Technology: Surface Mount; Pins: 2; Package Shape: Rectangular; Case/Package: 0201; Terminal Finish: Nickel; Min Operating Temperature: -55°C; Max Operating Temperature: 155°C; JESD-609 Code: e3; Resistor Type: FIXED RESISTOR; Construction: Chip; Package Style: SMTMeter; Packaging: Tape and Reel; Technology: METAL GLAZE/THICK FILM; Termination: Wraparound; Working Voltage: 30V; Reach SVHC Compliant: Yes; RoHS Compliant: Yes; ComponentLink1URL: https://datasheet.ciiva.com:443/pdfs/VipMasterIC/IC/VISH/VISH-S-A0002932828/VISH-S-A0002932828-1.pdf?src-supplier=IHS+Markit; ComponentLink1Description: https://datasheet.ciiva.com:443/pdfs/VipMasterIC/IC/VISH/VISH-S-A0002932828/VISH-S-A0002932828-1.pdf?src-supplier=IHS+Markit; ComponentLink2URL: https://datasheet.ciiva.com/5915/1719906-5915662.pdf?src-supplier=Farnell; ComponentLink2Description: https://datasheet.ciiva.com/5915/1719906-5915662.pdf?src-supplier=Farnell; ComponentLink3URL: https://datasheet.ciiva.com/5915/1719906-5915663.pdf?src-supplier=Farnell; ComponentLink3Description: https://datasheet.ciiva.com/5915/1719906-5915663.pdf?src-supplier=Farnell; ComponentLink4URL: https://datasheet.ciiva.com/7690/1719906-7690602.pdf?src-supplier=Element14; ComponentLink4Description: https://datasheet.ciiva.com/7690/1719906-7690602.pdf?src-supplier=Element14; ComponentLink5URL: https://datasheet.ciiva.com/7690/1719906-7690603.pdf?src-supplier=Element14; ComponentLink5Description: https://datasheet.ciiva.com/7690/1719906-7690603.pdf?src-supplier=Element14; ComponentLink6URL: https://datasheet.ciiva.com/22700/1719906-22700665.pdf?src-supplier=Element14; ComponentLink6Description: https://datasheet.ciiva.com/22700/1719906-22700665.pdf?src-supplier=Element14; Supplier 1: Digikey; Supplier Part Number 1: 541-CRCW02012K80FNEDCT-ND
TP900-TP902 = Test Point: Test pad, 0.90mm circular pad; PCB Footprint: testpad_0p90mm; Length (mm): 0.90; Manufacturer: N/A; Manufacturer PN: N/A; Medical Grade MFR: N/A; Medical Grade MFR PN: N/A; Rating: N/A; Thickness (mm): N/A; Value: Test point; Width (mm): 0.90; Category: Test point; Status: *; Review: *
U900 = SN74LVC1G123YZPR: Monostable, RC set, dual triggers, BGA-8; Medical Grade MFR: TBD; Category: IC; Length (mm): 1.89 ±0.03; Medical Grade MFR PN: TBD; Package Description: TBD; PCB Footprint: TBD; Rating: TBD; Thickness (mm): 0.50; Value: SN74LVC1G123YZPR; Width (mm): 0.89 ±0.03; Supplier 1: Digi-Key; Supplier Part Number 1: 296-21058-1-ND; Status: *; Review: *; Manufacturer Part Number: SN74LVC1G123YZPR
U901 = SN74LVC2G08YZPR: AND gate, Dual 2-input, BGA-8; Medical Grade MFR: TBD; Category: IC; Length (mm): 1.89 ±0.03; Medical Grade MFR PN: TBD; Package Description: TBD; PCB Footprint: TBD; Rating: TBD; Thickness (mm): 0.50; Value: SN74LVC2G08YZPR; Width (mm): 0.89 ±0.03; Supplier 1: Digi-Key; Supplier Part Number 1: 296-14371-1-ND; Status: *; Review: *; Manufacturer Part Number: SN74LVC2G08YZPR
U902 = DAC80502DRXT: DAC, 16-bit, Dual channel, SPI/I2C, WSON-10; Rating: 2.7-5.5V; Category: IC; Length (mm): 2.50 ±0.10; Medical Grade MFR: N/A; Medical Grade MFR PN: N/A; Package Description: N/A; PCB Footprint: N/A; Thickness (mm): 0.75 ±0.05; Value: DAC80502DRXT; Width (mm): 2.50 ±0.10; Supplier 1: Digi-Key; Supplier Part Number 1: 296-DAC80502DRXTCT-ND; Status: *; Review: *; Manufacturer Part Number: DAC80502DRXT
U903 U904 = TS5A3159AYZPR: Analog Switch, SPDT, 2:1, DSBGA6; Medical Grade MFR: TBD; Rating: 5.0V; Category: IC; Length (mm): 1.39 ±0.03; Thickness (mm): 0.50 ±0.10; Width (mm): 0.89 ±0.03; Medical Grade MFR PN: TBD; Package Description: TBD; PCB Footprint: TBD; Value: TS5A3159AYZPR; Supplier 1: Digi-Key; Supplier Part Number 1: 296-18671-1-ND; Status: *; Review: *; Manufacturer Part Number: TS5A3159AYZPR
U905 = TLV9002SIYCKR: Op Amp, Dual, Rail-to-Rail, 1MHz, BGA-9; Medical Grade MFR: TBD; Rating: 5.5V; Category: IC; Length (mm): 0.95 ±0.03; Medical Grade MFR PN: TBD; Package Description: TBD; PCB Footprint: TBD; Thickness (mm): 0.33; Value: TLV9002SIYCKR; Width (mm): 0.95 ±0.03; Supplier 1: Digi-Key; Supplier Part Number 1: 296-TLV9002SIYCKRCT-ND; Status: *; Review: *; Manufacturer Part Number: TLV9002SIYCKR